# Altium schematic sheet Modem.SchDoc
size A4
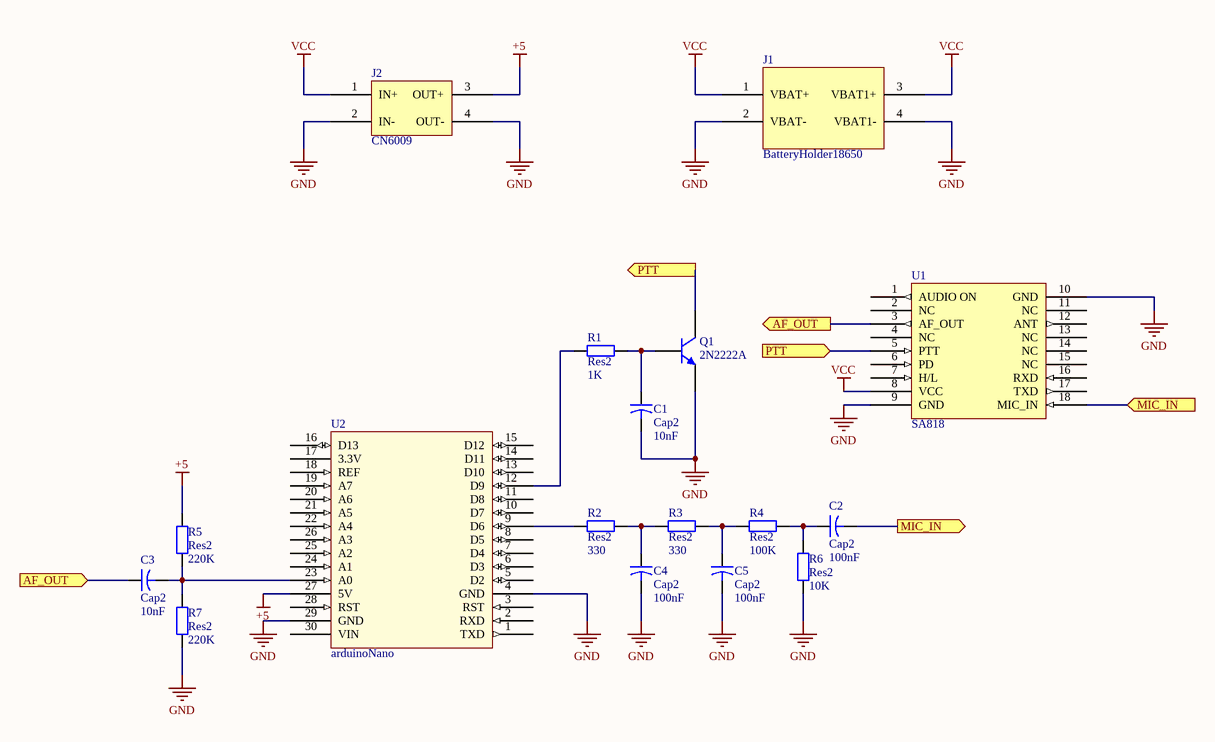
[diagram p0: Modem.SchDoc]

## Parts
C1  Cap2  value 10nF  [CAPR5-4X5]
C2  Cap2  value 100nF  [CAPR5-4X5]
C3  Cap2  value 10nF  [CAPR5-4X5]
C4  Cap2  value 100nF  [CAPR5-4X5]
C5  Cap2  value 100nF  [CAPR5-4X5]
J1  BatteryHolder18650  [BatteryHolder18650]
J2  CN6009  [CN6009]
Q1  2N2222A  [TO-18]
R1  Res2  value 1K  [AXIAL-0.4]
R2  Res2  value 330  [AXIAL-0.4]
R3  Res2  value 330  [AXIAL-0.4]
R4  Res2  value 100K  [AXIAL-0.4]
R5  Res2  value 220K  [AXIAL-0.4]
R6  Res2  value 10K  [AXIAL-0.4]
R7  Res2  value 220K  [AXIAL-0.4]
U1  SA818  [SA818]
U2  arduinoNano  [Arduino nano]

## Ports
AF_OUT (in), AF_OUT (out), MIC_IN (in), MIC_IN (out), PTT (in), PTT (out)

## Nets
+5: J2.3(OUT+) R5.2 U2.27(5V)
GND: C1.2 C4.2 C5.2 J1.2(VBAT-) J1.4(VBAT1-) J2.2(IN-) J2.4(OUT-) Q1.3(E) R6.1 R7.1 U1.9(GND) U1.10(GND) U2.4(GND) U2.29(GND)
VCC: J1.1(VBAT+) J1.3(VBAT1+) J2.1(IN+) U1.8(VCC)
AF_OUT: C3.1 U1.3(AF_OUT) ; port AF_OUT
MIC_IN: C2.2 U1.18(MIC_IN) ; port MIC_IN
PTT: Q1.2(C) U1.5(PTT) ; port PTT
NetC1_1: C1.1 Q1.1(B) R1.2
NetC2_1: C2.1 R4.2 R6.2
NetC3_2: C3.2 R5.1 R7.2 U2.23(A0)
NetC4_1: C4.1 R2.2 R3.1
NetC5_1: C5.1 R3.2 R4.1
NetR1_1: R1.1 U2.12(D9)
NetR2_1: R2.1 U2.9(D6)

Not connected (* = marked no-connect by the designer): U1 1(AUDIO_ON) 2(NC) 4(NC) 6(PD) 7(H/L) 11(NC) 12(ANT) 13(NC) 14(NC) 15(NC) 16(RXD) 17(TXD); U2 1(TXD) 2(RXD) 3(RST) 5(D2) 6(D3) 7(D4) 8(D5) 10(D7) 11(D8) 13(D10) 14(D11) 15(D12) 16(D13) 17(3.3V) 18(REF) 19(A7) 20(A6) 21(A5) 22(A4) 24(A1) 25(A2) 26(A3) 28(RST) 30(VIN)

## Library data of the parts
C1-C5 = Cap2: Capacitor; Published: 23-Sep-2002; PackageReference: CAPR5-4X5; Publisher: Altium Limited; PackageDescription: Capacitor; 2 Leads
Q1 = 2N2222A: High Speed Switches; Published: 8-Jun-2000; LatestRevisionDate: 11-Dec-2002; LatestRevisionNote: Sim Port Map correction; DatasheetVersion: Jun-1999; PackageReference: TO-18; Publisher: Altium Limited; PackageDescription: Can; 3 Leads; Pin Circle Dia. 2.54 mm; Lead Dia. 0.49 mm (max); ComponentLink1Description: Manufacturer Link; ComponentLink1URL: http://www.st.com/; ComponentLink2Description: Datasheet; ComponentLink2URL: http://www.st.com/stonline/products/literature/ds/9288/2n2219a.pdf
R1-R7 = Res2: Resistor; Published: 8-Jun-2000; LatestRevisionDate: 17-Jul-2002; LatestRevisionNote: Re-released for DXP Platform.; PackageReference: AXIAL-0.4; Publisher: Altium Limited; PackageDescription: Axial Device, Thru-Hole; 2 Leads; 0.4 in Pin Spacing